# Altium project Control_Board_Model_C.PrjPcb (part 1 of 4)
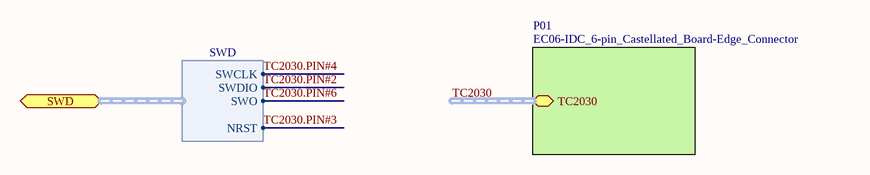
[diagram p0: SWD_TagConnect.SchDoc]
_address1: 30 N Gould St suite 4000; _address2: Sheridan WY 82801; _ApprovedBy: PGU; _BoardName: Control_Board; _CompanyName: Acme_CPU; _DateCode: 2021.12; _DocumentDate: 20210305; _HWEngineer: VSI; _PCBModel: C202; _PCBNumber: 001; _Revision: 0.1; _Title: Control_Board
12 sheets, 131 parts. Net scope: hierarchical (ports join the sheet entries above them; power ports are global).
Board files: Control_Board_Model_C_Rigid_Flex.PcbDoc, Control_Board_Model_C_Rigid_Flex_Flipped.PcbDoc
Sheets:
  SWD_TagConnect.SchDoc
  Analog_Signal_Conditioner_V2.SchDoc
  Top_Level_Block_Diagram.SchDoc
    TCPC = USB_Type-C_Port_V2.0.SchDoc
    TP = Test_Points.SchDoc
    BC = bq25611d_Battery_Charger.SchDoc
    P109 = BG95_Broadband_Modem.SchDoc
      BG95_RF = BG95_RF.SchDoc
      BG95_VLT = BG95_VLT.SchDoc
    AUDIO = Audio_Module.SchDoc
      CODEC = CMX655D_Audio_CODEC_PA.SchDoc
  SIT1533_Oscillator.SchDoc

## Sheet SWD_TagConnect.SchDoc: Tag-Connect SWD Port
size A4; DocumentNumber: 7; SheetNumber: 7; SheetTotal: 51

### Sub-sheets
P01 = EC06-IDC_6-pin_Castellated_Board-Edge_Connector (file not in this document): TC2030 (harness TC2030)

### Ports
SWD (harness SWD)

### Harnesses
SWD: SWDIO, SWCLK, NRST, SWO

### Nets
TC2030.PIN#2: port SWD.SWDIO
TC2030.PIN#3: port SWD.NRST
TC2030.PIN#4: port SWD.SWCLK
TC2030.PIN#6: port SWD.SWO

### Buses and harness runs
harness TC2030 = sheet P01/TC2030

### Notes on the sheet
- Title
- Size:
- Date:
- A4
- Number:
- Time:
- Revision:
- Sheet
- of
- File:

## Sheet Analog_Signal_Conditioner_V2.SchDoc: Analog Signal Conditioner
size A4; DocumentNumber: 6; SheetNumber: 6; SheetTotal: 51
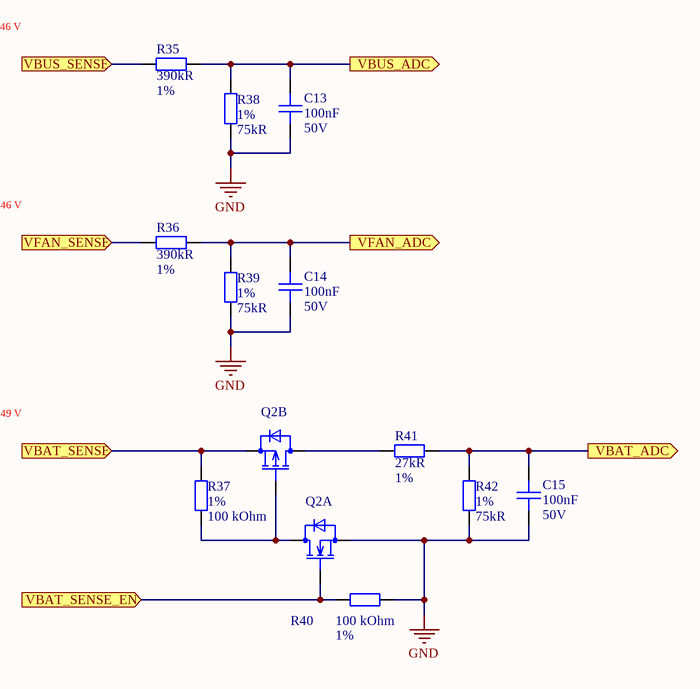
[diagram p1: Analog_Signal_Conditioner_V2.SchDoc]

### Parts
C13  Capacitance: 100nF  Voltage: 50V  [C0402]  (hidden comment: CAP CER 0.1UF 50V X7R 0402)
C14  Capacitance: 100nF  Voltage: 50V  [C0402]  (hidden comment: CAP CER 0.1UF 50V X7R 0402)
C15  Capacitance: 100nF  Voltage: 50V  [C0402]  (hidden comment: CAP CER 0.1UF 50V X7R 0402)
Q2  EM6M2T2R  [SON_400UV-7_DIO]  (value not drawn)  (parts A,B of 2)
R35  Resistance: 390kR  Tolerance: 1%  [R0402]  (hidden comment: RES SMD 390K OHM 1% 1/16W 0402)
R36  Resistance: 390kR  Tolerance: 1%  [R0402]  (hidden comment: RES SMD 390K OHM 1% 1/16W 0402)
R37  Tolerance: 1%  Resistance: 100 kOhm  [R0402]  (hidden comment: RES SMD 100K OHM 1% 1/16W 0402)
R38  Tolerance: 1%  Resistance: 75kR  [R0402]  (hidden comment: RES SMD 75K OHM 1% 1/16W 0402)
R39  Tolerance: 1%  Resistance: 75kR  [R0402]  (hidden comment: RES SMD 75K OHM 1% 1/16W 0402)
R40  Tolerance: 1%  Resistance: 100 kOhm  [R0402]  (hidden comment: RES SMD 100K OHM 1% 1/16W 0402)
R41  Resistance: 27kR  Tolerance: 1%  [R0402]  (hidden comment: RES SMD 27K OHM 1% 1/16W 0402)
R42  Tolerance: 1%  Resistance: 75kR  [R0402]  (hidden comment: RES SMD 75K OHM 1% 1/16W 0402)

### Ports
VBAT_ADC (out), VBAT_SENSE (in), VBAT_SENSE_EN (in), VBUS_ADC (out), VBUS_SENSE (in), VFAN_ADC (out), VFAN_SENSE (in)

### Nets
GND: C13.1 C14.1 C15.1 Q2.1(S) R38.1 R39.1 R40.1 R42.1
NetC13_2: C13.2 R35.2 R38.2 ; port VBUS_ADC
NetC14_2: C14.2 R36.2 R39.2 ; port VFAN_ADC
NetC15_2: C15.2 R41.2 R42.2 ; port VBAT_ADC
NetQ2_2: Q2.2(G) R40.2 ; port VBAT_SENSE_EN
NetQ2_3: Q2.3(D) R41.1
NetQ2_4: Q2.4(S) R37.2 ; port VBAT_SENSE
NetQ2_5: Q2.5(G) Q2.6(D) R37.1
NetR35_1: R35.1 ; port VBUS_SENSE
NetR36_1: R36.1 ; port VFAN_SENSE

### Notes on the sheet
- (near R35) VBUS_SENSE max = 20.46 V
- (near R36) VFAN_SENSE max = 20.46 V
- VBAT_SENSE max = 4.49 V
- Title
- Size:
- Date:
- A4
- Number:
- Time:
- Revision:
- Sheet
- of
- File:

### Library data of the parts
C13-C15 = CAP CER 0.1UF 50V X7R 0402: 0.1µF ±10% 50V Ceramic Capacitor X7R 0402 (1005 Metric); Manufacturer Part Number: CGA2B3X7R1H104K050BB; Manufacturer: TDK; Supplier 1: Digi-Key; Stock 1: 2925303; Pricing 1: 1=0.17, 10=0.118, 50=0.0668, 100=0.0553, 500=0.0388, 1000=0.0321, 2500=0.0299, 5000=0.0273 (USD); Mount: Surface Mount; Case Code (Metric): 1005; Case Code (Imperial): 0402; Min Operating Temperature: -55°C; Max Operating Temperature: 125°C; Tolerance: 10%; Dielectric: X7R; Voltage Rating: 50V; Voltage Rating (DC): 50V; Packaging: Tape and Reel; Package Quantity: 1; Termination: SMD/SMT; Composition: Ceramic; Length: 1mm; Height: 0.5mm; Width: 0.02inch; Thickness: 0.022inch; Depth: 0.5mm; REACH SVHC: No SVHC; Lead Free: Lead Free; ComponentLink1URL: http://product.tdk.com/capacitor/mlcc/en/documents/mlccspec_automotive_general_midvoltage_en.pdf?src-supplier=Future+Electronics; ComponentLink1Description: http://product.tdk.com/capacitor/mlcc/en/documents/mlccspec_automotive_general_midvoltage_en.pdf?src-supplier=Future+Electronics; ComponentLink2URL: http://www.farnell.com/datasheets/1807242.pdf?src-supplier=Element14; ComponentLink2Description: http://www.farnell.com/datasheets/1807242.pdf?src-supplier=Element14; ComponentLink3URL: http://www.mouser.com/ds/2/400/lcc_automotive_general_en-843974.pdf?src-supplier=Mouser; ComponentLink3Description: http://www.mouser.com/ds/2/400/lcc_automotive_general_en-843974.pdf?src-supplier=Mouser; ComponentLink4URL: http://www.farnell.com/datasheets/1936565.pdf?src-supplier=Element14; ComponentLink4Description: http://www.farnell.com/datasheets/1936565.pdf?src-supplier=Element14; ComponentLink5URL: http://www.farnell.com/datasheets/1735392.pdf?src-supplier=Element14; ComponentLink5Description: http://www.farnell.com/datasheets/1735392.pdf?src-supplier=Element14; Supplier Part Number 1: 445-6899-1-ND; Case/Package: 0402; Weight: 2.3E-05oz; Ratings: AEC-Q200; ClassName: STM32G473CETx
Q2 = ARRAY MOSFET N/P-CH 20V 0.2A EMT6: Mosfet Array N and P-Channel 20V 200mA 150mW Surface Mount EMT6; Manufacturer: Rohm; Rds On Max: 1R; Input Capacitance: 25pF; Supplier 1: Digi-Key; Manufacturer Part Number: EM6M2T2R; Stock 1: 84378; Pricing 1: 1=0.44, 10=0.375, 25=0.35, 100=0.26, 250=0.247, 500=0.203, 1000=0.165, 2500=0.155 (USD); Mount: Surface Mount; Case/Package: SOT-23-5; Number of Pins: 6; Min Operating Temperature: -55°C; Max Operating Temperature: 150°C; Packaging: Tape and Reel; Package Quantity: 1; Drain to Source Voltage (Vdss): 20V; Continuous Drain Current (ID): 200mA; Max Power Dissipation: 150mW; Drain to Source Resistance: 1R; FET Type: N and P-Channel; Radiation Hardening: No; Lead Free: Lead Free; ComponentLink1URL: http://rohmfs.rohm.com/en/techdata_basic/transistor/taping/EMT6_T2R_taping.pdf?src-supplier=Digi-Key; ComponentLink1Description: http://rohmfs.rohm.com/en/techdata_basic/transistor/taping/EMT6_T2R_taping.pdf?src-supplier=Digi-Key; Supplier Part Number 1: EM6M2T2RCT-ND; ClassName: STM32G473CETx
R35 R36 = RES SMD 390K OHM 1% 1/16W 0402: 390 kOhms ±1% 0.063W, 1/16W Chip Resistor 0402 (1005 Metric) Moisture Resistant Thick Film; Manufacturer: Yageo; Manufacturer Part Number: RC0402FR-07390KL; Power Rating: 62.5mW; Voltage Rating: 50V; Temperature Coefficient: 100ppm/°C; Max Power Dissipation: 63mW; Supplier 1: Digi-Key; Stock 1: 118017; Pricing 1: 1=0.1, 10=0.016, 100=0.0064, 1000=0.0029, 2500=0.0025, 5000=0.0021 (USD); Case/Package: 0402; Weight: 2.3E-05oz; Case Code (Imperial): 0402; Case Code (Metric): 1005; Min Operating Temperature: -55°C; Max Operating Temperature: 155°C; Packaging: Tape and Reel; Composition: Thick Film; Number of Terminations: 2; Termination: SMD/SMT; Military Standard: Not; Features: Moisture Resistant; Length: 1mm; Height: 0.016inch; Width: 0.02inch; Depth: 0.5mm; REACH SVHC: Unknown; Lead Free: Lead Free; ComponentLink1URL: http://www.yageo.com/documents/recent/PYu-RC0402_51_RoHS_L_6.pdf?src-supplier=Future+Electronics; ComponentLink1Description: http://www.yageo.com/documents/recent/PYu-RC0402_51_RoHS_L_6.pdf?src-supplier=Future+Electronics; ComponentLink2URL: http://www.farnell.com/datasheets/2167052.pdf?src-supplier=Element14; ComponentLink2Description: http://www.farnell.com/datasheets/2167052.pdf?src-supplier=Element14; ComponentLink3URL: http://www.mouser.com/ds/2/447/PYu-RC0402_51_RoHS_L_6_r-8721.pdf?src-supplier=Mouser; ComponentLink3Description: http://www.mouser.com/ds/2/447/PYu-RC0402_51_RoHS_L_6_r-8721.pdf?src-supplier=Mouser; Supplier Part Number 1: YAG3143CT-ND; ClassName: STM32G473CETx; Mount: Surface Mount
R37 R40 = RES SMD 100K OHM 1% 1/16W 0402: 100 kOhms ±1% 0.063W, 1/16W Chip Resistor 0402 (1005 Metric) Moisture Resistant Thick Film; Manufacturer: Yageo; Manufacturer Part Number: RC0402FR-07100KL; Temperature Coefficient: 100ppm/°C; Power Rating: 63mW; Voltage Rating: 50V; Supplier 1: Digi-Key; Stock 1: 47448883; Pricing 1: 1=0.1, 10=0.016, 100=0.0064, 1000=0.0029, 2500=0.0025, 5000=0.0021 (USD); Case Code (Metric): 1005; Case Code (Imperial): 0402; Min Operating Temperature: -55°C; Max Operating Temperature: 155°C; Composition: Thick Film; Packaging: Tape and Reel; Package Quantity: 1; Number of Terminations: 2; Termination: SMD/SMT; Military Standard: Not; Max Power Dissipation: 63mW; Working Voltage: 50V; Features: Moisture Resistant; Length: 0.039inch; Height: 0.016inch; Width: 0.02inch; Depth: 0.5mm; REACH SVHC: No SVHC; Lead Free: Lead Free; ComponentLink1URL: http://www.yageo.com/documents/recent/PYu-RC_Group_51_RoHS_L_10.pdf?src-supplier=Digi-Key; ComponentLink1Description: http://www.yageo.com/documents/recent/PYu-RC_Group_51_RoHS_L_10.pdf?src-supplier=Digi-Key; ComponentLink2URL: http://www.farnell.com/datasheets/1018594.pdf?src-supplier=Element14; ComponentLink2Description: http://www.farnell.com/datasheets/1018594.pdf?src-supplier=Element14; ComponentLink3URL: http://www.yageo.com/documents/recent/PYu-RC_Group_51_RoHS_L_9.pdf?src-supplier=Verical; ComponentLink3Description: http://www.yageo.com/documents/recent/PYu-RC_Group_51_RoHS_L_9.pdf?src-supplier=Verical; ComponentLink4URL: http://www.yageo.com/documents/recent/PYu-RC_Group_51_RoHS_L_9.pdf?src-supplier=Mouser; ComponentLink4Description: http://www.yageo.com/documents/recent/PYu-RC_Group_51_RoHS_L_9.pdf?src-supplier=Mouser; ComponentLink5URL: http://documents.rs-components.com/techlib://itc_doclist_GB.htm?stockno=6185797&src-supplier=RSComponents; ComponentLink5Description: http://documents.rs-components.com/techlib://itc_doclist_GB.htm?stockno=6185797&src-supplier=RSComponents; Supplier Part Number 1: 311-100KLRDKR-ND; Case/Package: 0402; ClassName: STM32G473CETx; Mount: Surface Mount
R38 R39 R42 = RES SMD 75K OHM 1% 1/16W 0402: 75 kOhms ±1% 0.063W, 1/16W Chip Resistor 0402 (1005 Metric) Automotive AEC-Q200 Thick Film; Manufacturer: Stackpole Electronics; Manufacturer Part Number: RMCF0402FT75K0; Power Rating: 63mW; Temperature Coefficient: 100ppm/°C; Supplier 1: Digi-Key; Stock 1: 24693; Pricing 1: 1=0.1, 10=0.014, 100=0.0058, 1000=0.0026, 2500=0.0023, 5000=0.0019 (USD); Mount: Surface Mount; Case/Package: 0402; Case Code (Metric): 1005; Case Code (Imperial): 0402; Contact Plating: Tin,Matte; Min Operating Temperature: -55°C; Max Operating Temperature: 155°C; Features: Automotive AEC-Q200; Packaging: Tape and Reel; Composition: Thick Film; Number of Terminations: 2; Military Standard: Not; Max Power Dissipation: 63mW; Length: 0.039inch; Height: 0.016inch; Width: 0.02inch; Depth: 0.5mm; Radiation Hardening: No; Lead Free: Lead Free; ComponentLink1URL: https://www.seielect.com/catalog/SEI-Packaging.pdf?src-supplier=Digi-Key; ComponentLink1Description: https://www.seielect.com/catalog/SEI-Packaging.pdf?src-supplier=Digi-Key; ComponentLink2URL: http://www.seielect.com/Catalog/Sei-RMC.pdf?src-supplier=Future+Electronics; ComponentLink2Description: http://www.seielect.com/Catalog/Sei-RMC.pdf?src-supplier=Future+Electronics; ComponentLink3URL: https://www.seielect.com/catalog/SEI-RMCF_RMCP.pdf?src-supplier=Avnet; ComponentLink3Description: https://www.seielect.com/catalog/SEI-RMCF_RMCP.pdf?src-supplier=Avnet; ComponentLink4URL: http://components.arrow.com/part/dataview/47811039S7743759N1174?src-supplier=Arrow; ComponentLink4Description: http://components.arrow.com/part/dataview/47811039S7743759N1174?src-supplier=Arrow; ComponentLink5URL: https://www.verical.com/server-webapp/html/getDatasheet?partID=492569&src-supplier=Verical; ComponentLink5Description: https://www.verical.com/server-webapp/html/getDatasheet?partID=492569&src-supplier=Verical; Supplier Part Number 1: RMCF0402FT75K0CT-ND; ClassName: STM32G473CETx
R41 = RES SMD 27K OHM 1% 1/16W 0402: 27 kOhms ±1% 0.063W, 1/16W Chip Resistor 0402 (1005 Metric) Moisture Resistant Thick Film; Manufacturer: Yageo; Manufacturer Part Number: RC0402FR-0727KL; Power Rating: 63mW; Voltage Rating: 50V; Temperature Coefficient: 100ppm/°C; Supplier 1: Digi-Key; Stock 1: 1508379; Pricing 1: 1=0.1, 10=0.016, 100=0.0064, 1000=0.0029, 2500=0.0025, 5000=0.0021 (USD); Case/Package: 0402; Case Code (Imperial): 0402; Case Code (Metric): 1005; Min Operating Temperature: -55°C; Max Operating Temperature: 155°C; Packaging: Tape and Reel; Composition: Thick Film; Number of Terminations: 2; Termination: SMD/SMT; Military Standard: Not; Max Power Dissipation: 63mW; Features: Moisture Resistant; Length: 1mm; Height: 0.016inch; Width: 0.02inch; Depth: 0.5mm; Lead Free: Lead Free; ComponentLink1URL: http://www.farnell.com/datasheets/2167052.pdf?src-supplier=Element14; ComponentLink1Description: http://www.farnell.com/datasheets/2167052.pdf?src-supplier=Element14; ComponentLink2URL: http://documents.rs-components.com/techlib://itc_doclist_GB.htm?stockno=6186475&src-supplier=RSComponents; ComponentLink2Description: http://documents.rs-components.com/techlib://itc_doclist_GB.htm?stockno=6186475&src-supplier=RSComponents; ComponentLink3URL: http://www.yageo.com/documents/recent/PYu-RC_Group_51_RoHS_L_10.pdf?src-supplier=Digi-Key; ComponentLink3Description: http://www.yageo.com/documents/recent/PYu-RC_Group_51_RoHS_L_10.pdf?src-supplier=Digi-Key; Supplier Part Number 1: 311-27.0KLRCT-ND; ComponentLink4URL: http://www.yageo.com/documents/recent/PYu-RC0402_51_RoHS_L_6_r.pdf?src-supplier=Future+Electronics; ComponentLink4Description: http://www.yageo.com/documents/recent/PYu-RC0402_51_RoHS_L_6_r.pdf?src-supplier=Future+Electronics; Package Quantity: 10000; REACH SVHC: Unknown; ClassName: STM32G473CETx; Mount: Surface Mount

## Sheet Top_Level_Block_Diagram.SchDoc: BLDC Motor Driver Block Diagram
size A3; DocumentNumber: 1; SheetNumber: 1; SheetTotal: 51
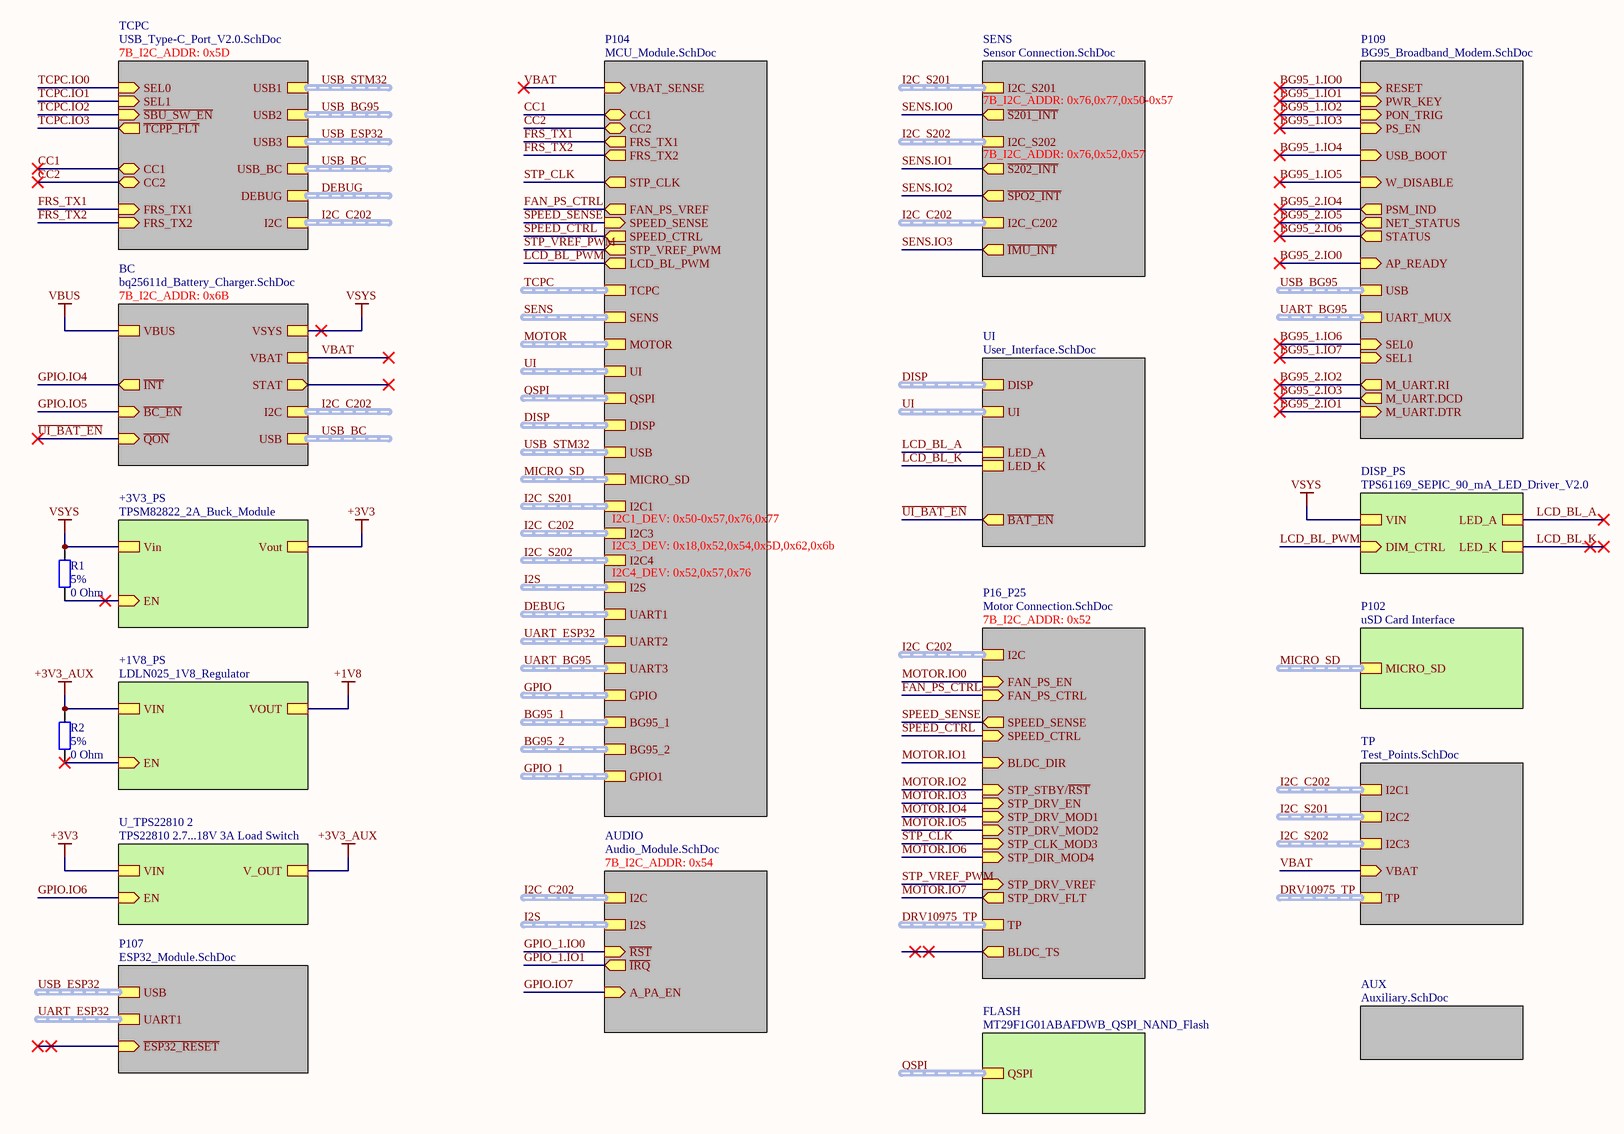
[diagram p2: Top_Level_Block_Diagram.SchDoc]

### Parts
R1  Tolerance: 5%  Resistance: 0 Ohm  [R0402]  (hidden comment: RES SMD 0 OHM JUMPER 1/16W 0402)
R2  Tolerance: 5%  Resistance: 0 Ohm  [R0402]  (hidden comment: RES SMD 0 OHM JUMPER 1/16W 0402)

### Sub-sheets
+1V8_PS = LDLN025_1V8_Regulator (file not in this document): EN (in), VIN, VOUT
+3V3_PS = TPSM82822_2A_Buck_Module (file not in this document): Vout, Vin, EN (in)
AUDIO = Audio_Module.SchDoc: I2S (harness I2S), I2C (harness I2C), ~{RST} (in), ~{IRQ} (out), A_PA_EN (in)  | 7B_I2C_ADDR: 0x54
AUX = Auxiliary.SchDoc (file not in this document): no entries
BC = bq25611d_Battery_Charger.SchDoc: VSYS, VBUS, ~{QON} (in), USB (harness USB), I2C (harness I2C), ~{INT} (out), STAT (out), ~{BC_EN} (in), VBAT  | 7B_I2C_ADDR: 0x6B
DISP_PS = TPS61169_SEPIC_90_mA_LED_Driver_V2.0 (file not in this document): VIN, LED_K, DIM_CTRL (in), LED_A
FLASH = MT29F1G01ABAFDWB_QSPI_NAND_Flash (file not in this document): QSPI (harness QSPI)
P16_P25 = Motor Connection.SchDoc (file not in this document): SPEED_CTRL (in), SPEED_SENSE (out), FAN_PS_CTRL (in), BLDC_DIR (in), I2C (harness I2C), STP_STBY/~{RST} (in), STP_DRV_EN (in), STP_DRV_MOD1 (in), STP_DRV_MOD2 (in), STP_CLK_MOD3 (in), STP_DIR_MOD4 (in), STP_DRV_VREF (in), STP_DRV_FLT (out), FAN_PS_EN (in), TP (harness DRV10975_TP), BLDC_TS (out)  | 7B_I2C_ADDR: 0x52
P102 = uSD Card Interface (file not in this document): MICRO_SD (harness MICRO_SD)
P104 = MCU_Module.SchDoc (file not in this document): FAN_PS_VREF (out), SPEED_CTRL (out), SPEED_SENSE (in), CC2 (bidir), CC1 (bidir), I2C1 (harness I2C), VBAT_SENSE (in), MICRO_SD (harness MICRO_SD), DISP (harness DISP_SPI), USB (harness USB), STP_CLK (out), STP_VREF_PWM (out), LCD_BL_PWM (out), QSPI (harness QSPI), FRS_TX1 (out), FRS_TX2 (out), I2C3 (harness I2C), UART1 (harness DEBUG), I2C4 (harness I2C), UART3 (harness UART), I2S (harness I2S), UART2 (harness UART), GPIO (harness GPIO), MOTOR (harness GPIO), BG95_1 (harness GPIO), SENS (harness GPIO), BG95_2 (harness GPIO), UI (harness GPIO), TCPC (harness GPIO), GPIO1 (harness GPIO)  | I2C3_DEV: 0x18,0x52,0x54,0x5D,0x62,0x6b; I2C1_DEV: 0x50-0x57,0x76,0x77; I2C4_DEV: 0x52,0x57,0x76
P107 = ESP32_Module.SchDoc (file not in this document): ~{ESP32_RESET} (in), UART1 (harness UART), USB (harness USB)
P109 = BG95_Broadband_Modem.SchDoc: PWR_KEY (in), PON_TRIG (in), W_DISABLE (in), USB_BOOT (in), NET_STATUS (out), AP_READY (in), STATUS (out), PSM_IND (out), PS_EN (in), RESET (in), USB (harness USB), SEL1 (in), SEL0 (in), UART_MUX (harness UART), M_UART.RI (out), M_UART.DCD (out), M_UART.DTR (in)
SENS = Sensor Connection.SchDoc (file not in this document): ~{S201_INT} (out), I2C_S201 (harness I2C), I2C_S202 (harness I2C), ~{S202_INT} (out), ~{SPO2_INT} (out), I2C_C202 (harness I2C), ~{IMU_INT} (out)  | 7B_I2C_ADDR: 0x76,0x77,0x50-0x57; 7B_I2C_ADDR: 0x76,0x52,0x57
TCPC = USB_Type-C_Port_V2.0.SchDoc: CC1 (bidir), CC2 (bidir), USB1 (harness USB), USB2 (harness USB), SEL1 (in), SEL0 (in), ~{TCPP_FLT} (out), USB3 (harness USB), USB_BC (harness USB), FRS_TX1 (in), FRS_TX2 (in), I2C (harness I2C), ~{SBU_SW_EN} (in), DEBUG (harness DEBUG)  | 7B_I2C_ADDR: 0x5D
TP = Test_Points.SchDoc: I2C1 (harness I2C), I2C2 (harness I2C), I2C3 (harness I2C), VBAT (in), TP (harness DRV10975_TP)
U_TPS22810 2 = TPS22810 2.7...18V 3A Load Switch (file not in this document): EN (in), V_OUT, VIN
UI = User_Interface.SchDoc (file not in this document): ~{BAT_EN} (out), DISP (harness DISP_SPI), LED_A, LED_K, UI (harness GPIO)

### Nets
+3V3: sheet +3V3_PS/Vout, sheet U_TPS22810 2/VIN
+3V3_AUX: R2.2 ; sheet +1V8_PS/VIN, sheet U_TPS22810 2/V_OUT
VSYS: R1.2 ; sheet BC/VSYS, sheet +3V3_PS/Vin, sheet DISP_PS/VIN
~{UI_BAT_EN}: sheet BC/~{QON}, sheet UI/~{BAT_EN}
BG95_1.IO3: sheet P109/PS_EN
BG95_1.IO5: sheet P109/W_DISABLE  [project net B1_3]
BG95_2.IO0: sheet P109/AP_READY  [project net B1_0]
BG95_2.IO1: sheet P109/M_UART.DTR  [project net B1_4]
BG95_2.IO2: sheet P109/M_UART.RI  [project net B1_5]
BG95_2.IO3: sheet P109/M_UART.DCD  [project net B1_6]
BG95_2.IO4: sheet P109/PSM_IND  [project net B1_7]
BG95_2.IO5: sheet P109/NET_STATUS  [project net B1_2]
BG95_2.IO6: sheet P109/STATUS  [project net B1_1]
CC1: sheet TCPC/CC1, sheet P104/CC1
CC2: sheet TCPC/CC2, sheet P104/CC2
FAN_PS_CTRL: sheet P104/FAN_PS_VREF, sheet P16_P25/FAN_PS_CTRL
FRS_TX1: sheet TCPC/FRS_TX1, sheet P104/FRS_TX1
FRS_TX2: sheet TCPC/FRS_TX2, sheet P104/FRS_TX2
GPIO.IO6: sheet U_TPS22810 2/EN
GPIO.IO7: sheet AUDIO/A_PA_EN
LCD_BL_A: sheet UI/LED_A, sheet DISP_PS/LED_A
LCD_BL_K: sheet UI/LED_K, sheet DISP_PS/LED_K
LCD_BL_PWM: sheet P104/LCD_BL_PWM, sheet DISP_PS/DIM_CTRL
MOTOR.IO0: sheet P16_P25/FAN_PS_EN
MOTOR.IO1: sheet P16_P25/BLDC_DIR
MOTOR.IO2: sheet P16_P25/STP_STBY/~{RST}
MOTOR.IO3: sheet P16_P25/STP_DRV_EN
MOTOR.IO4: sheet P16_P25/STP_DRV_MOD1
MOTOR.IO5: sheet P16_P25/STP_DRV_MOD2
MOTOR.IO6: sheet P16_P25/STP_DIR_MOD4
MOTOR.IO7: sheet P16_P25/STP_DRV_FLT
SENS.IO0: sheet SENS/~{S201_INT}
SENS.IO1: sheet SENS/~{S202_INT}
SENS.IO2: sheet SENS/~{SPO2_INT}
SENS.IO3: sheet SENS/~{IMU_INT}
SPEED_CTRL: sheet P104/SPEED_CTRL, sheet P16_P25/SPEED_CTRL
SPEED_SENSE: sheet P104/SPEED_SENSE, sheet P16_P25/SPEED_SENSE
STP_CLK: sheet P104/STP_CLK, sheet P16_P25/STP_CLK_MOD3
STP_VREF_PWM: sheet P104/STP_VREF_PWM, sheet P16_P25/STP_DRV_VREF
TCPC.IO2: sheet TCPC/~{SBU_SW_EN}  [project net ~{SBU_SW_EN}]
TCPC.IO3: sheet TCPC/~{TCPP_FLT}
VBAT: sheet TP/VBAT, sheet P104/VBAT_SENSE, sheet BC/VBAT
NetR1_1: R1.1 ; sheet +3V3_PS/EN
NetR2_1: R2.1 ; sheet +1V8_PS/EN

### Buses and harness runs
harness BG95_1 = sheet P104/BG95_1
harness BG95_2 = sheet P104/BG95_2
harness DEBUG = sheet P104/UART1
harness DEBUG = sheet TCPC/DEBUG
harness DISP = sheet P104/DISP
harness DISP = sheet UI/DISP
harness DRV10975_TP = sheet P16_P25/TP
harness DRV10975_TP = sheet TP/TP
harness GPIO = sheet P104/GPIO
harness GPIO_1 = sheet P104/GPIO1
harness I2C_C202 = sheet AUDIO/I2C
harness I2C_C202 = sheet BC/I2C
harness I2C_C202 = sheet P16_P25/I2C
harness I2C_C202 = sheet P104/I2C3
harness I2C_C202 = sheet SENS/I2C_C202
harness I2C_C202 = sheet TCPC/I2C
harness I2C_C202 = sheet TP/I2C1
harness I2C_S201 = sheet P104/I2C1
harness I2C_S201 = sheet SENS/I2C_S201
harness I2C_S201 = sheet TP/I2C2
harness I2C_S202 = sheet P104/I2C4
harness I2C_S202 = sheet SENS/I2C_S202
harness I2C_S202 = sheet TP/I2C3
harness I2S = sheet AUDIO/I2S
harness I2S = sheet P104/I2S
harness MICRO_SD = sheet P102/MICRO_SD
harness MICRO_SD = sheet P104/MICRO_SD
harness MOTOR = sheet P104/MOTOR
harness QSPI = sheet FLASH/QSPI
harness QSPI = sheet P104/QSPI
harness SENS = sheet P104/SENS
harness TCPC = sheet P104/TCPC
harness UART_BG95 = sheet P104/UART3
harness UART_BG95 = sheet P109/UART_MUX
harness UART_ESP32 = sheet P104/UART2
harness UART_ESP32 = sheet P107/UART1
harness UI = sheet P104/UI
harness UI = sheet UI/UI
harness USB_BC = sheet BC/USB
harness USB_BC = sheet TCPC/USB_BC
harness USB_BG95 = sheet P109/USB
harness USB_BG95 = sheet TCPC/USB2
harness USB_ESP32 = sheet P107/USB
harness USB_ESP32 = sheet TCPC/USB3
harness USB_STM32 = sheet P104/USB
harness USB_STM32 = sheet TCPC/USB1

### Notes on the sheet
- Title
- Size:
- Date:
- A3
- Number:
- Time:
- Revision:
- Sheet
- of
- File:

### Library data of the parts
R1 R2 = RES SMD 0 OHM JUMPER 1/16W 0402: 0 Ohms Jumper 0.063W, 1/16W Chip Resistor 0402 (1005 Metric) Moisture Resistant Thick Film; Manufacturer: Yageo; Manufacturer Part Number: RC0402JR-070RL; Power Rating: 62.5mW; Voltage Rating: 50V; Max Power Dissipation: 63mW; Temperature Coefficient: 200ppm/°C; Supplier 1: Digi-Key; Stock 1: 46057148; Pricing 1: 1=0.1, 10=0.013, 25=0.0092, 50=0.0072, 100=0.0053, 250=0.004, 500=0.0032, 1000=0.0024, 5000=0.0017 (USD); Contact Plating: Tin,Matte; Case Code (Metric): 1005; Case Code (Imperial): 0402; Min Operating Temperature: -55°C; Max Operating Temperature: 155°C; Packaging: Tape and Reel; Composition: Thick Film; Package Quantity: 1; Number of Terminations: 2; Termination: SMD/SMT; Military Standard: Not; Features: Moisture Resistant; Length: 1mm; Height: 0.016inch; Width: 0.02inch; Depth: 0.5mm; Radiation Hardening: No; REACH SVHC: Unknown; Lead Free: Lead Free; ComponentLink1URL: http://www.yageo.com/documents/recent/PYu-RC_Group_51_RoHS_L_10.pdf?src-supplier=Digi-Key; ComponentLink1Description: http://www.yageo.com/documents/recent/PYu-RC_Group_51_RoHS_L_10.pdf?src-supplier=Digi-Key; ComponentLink2URL: http://www.yageo.com/documents/recent/PYu-RC0402_51_RoHS_L_6.pdf?src-supplier=Avnet+Europe; ComponentLink2Description: http://www.yageo.com/documents/recent/PYu-RC0402_51_RoHS_L_6.pdf?src-supplier=Avnet+Europe; ComponentLink3URL: http://www.farnell.com/datasheets/1018594.pdf?src-supplier=Element14; ComponentLink3Description: http://www.farnell.com/datasheets/1018594.pdf?src-supplier=Element14; ComponentLink4URL: https://www.verical.com/server-webapp/html/getDatasheet?partID=326379&src-supplier=Verical; ComponentLink4Description: https://www.verical.com/server-webapp/html/getDatasheet?partID=326379&src-supplier=Verical; ComponentLink5URL: http://www.farnell.com/datasheets/2167052.pdf?src-supplier=Element14; ComponentLink5Description: http://www.farnell.com/datasheets/2167052.pdf?src-supplier=Element14; Supplier Part Number 1: 311-0.0JRCT-ND; Case/Package: 0402; Mount: Surface Mount
  R1: ClassName: +3V3_PS
  R2: ClassName: +1V8_PS

## Sheet USB_Type-C_Port_V2.0.SchDoc: USB Type-C PD Port Controller V2.0
size A4; DocumentNumber: 2; SheetNumber: 2; SheetTotal: 51
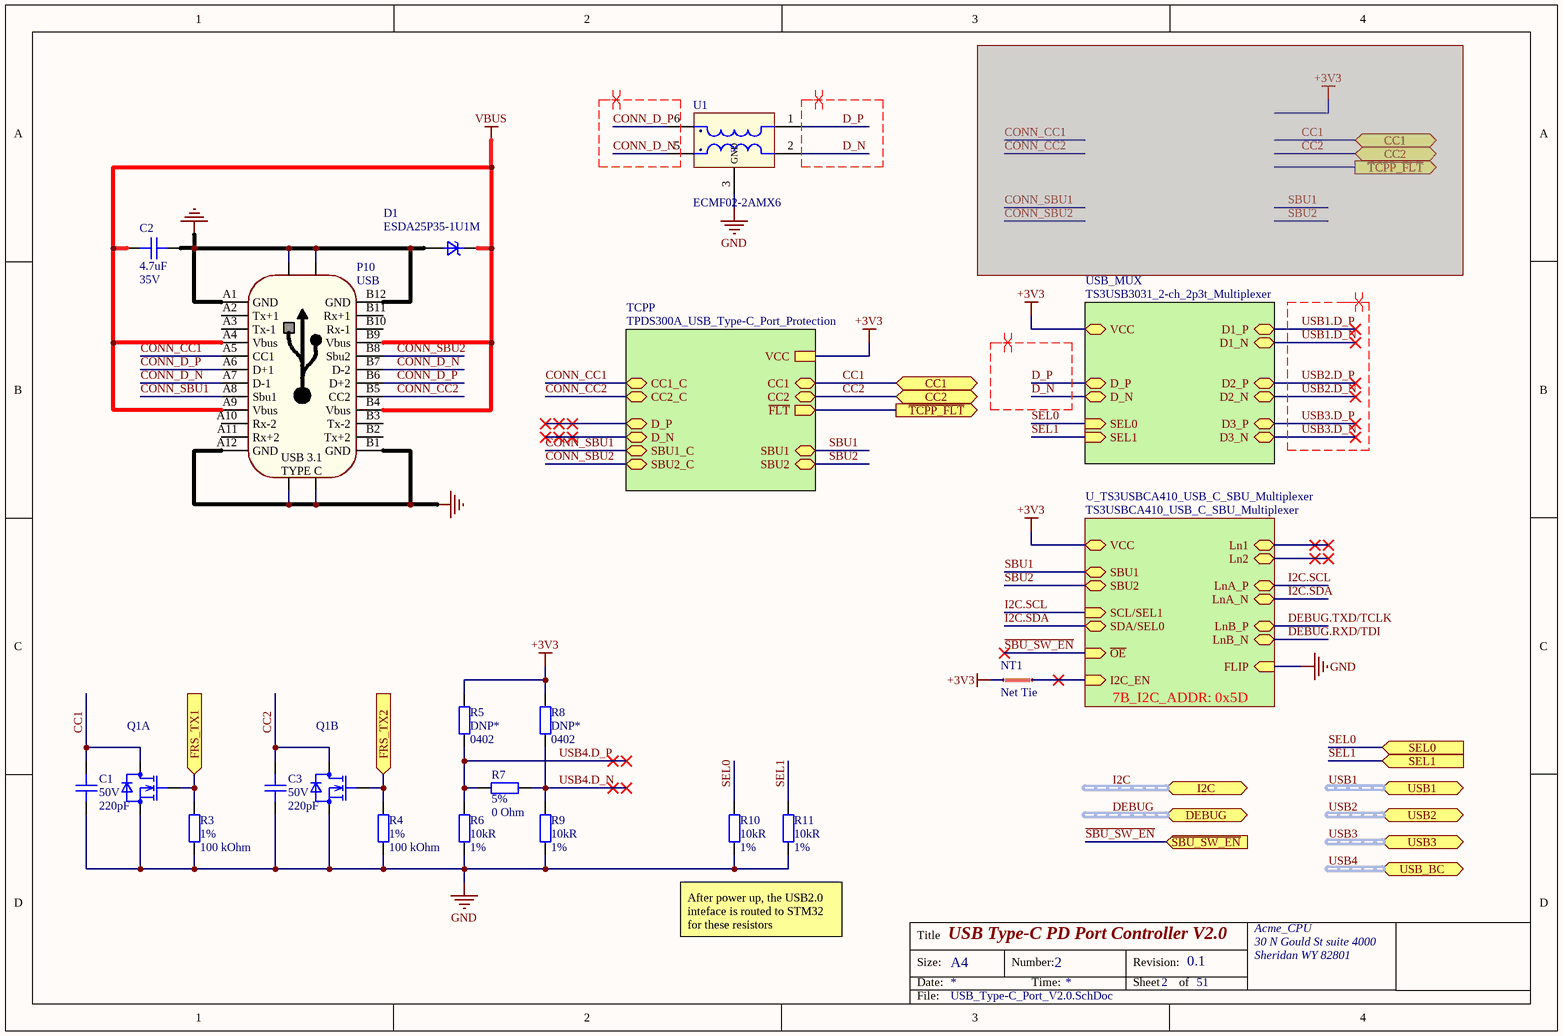
[diagram p3: USB_Type-C_Port_V2.0.SchDoc]

### Parts
C1  Voltage Rating: 50V  Capacitance: 220pF  [C0402]  (hidden comment: CAP CER 220PF 50V X7R 0402)
C2  Capacitance: 4.7uF  Voltage Rating: 35V  [C0805]  (hidden comment: CAP CER 4.7UF 35V X7R 0805)
C3  Voltage Rating: 50V  Capacitance: 220pF  [C0402]  (hidden comment: CAP CER 220PF 50V X7R 0402)
D1  ESDA25P35-1U1M  [ST_QFN_1610]
NT1  Net Tie  [Net Tie 6x30mil]  (net tie, no BOM)
P10  USB  [MOLEX_2012670005]
Q1  DMN32D2LV-7  [SON_400UV-7_DIO]  (value not drawn)  (parts A,B of 2)
R3  Tolerance: 1%  Resistance: 100 kOhm  [R0402]  (hidden comment: RES SMD 100K OHM 1% 1/16W 0402)
R4  Tolerance: 1%  Resistance: 100 kOhm  [R0402]  (hidden comment: RES SMD 100K OHM 1% 1/16W 0402)
R5  DNP*  Case/Package: 0402  [R0402]  (no BOM)
R6  Resistance: 10kR  Tolerance: 1%  [R0402]  (hidden comment: RES SMD 10K OHM 1% 1/16W 0402)
R7  Tolerance: 5%  Resistance: 0 Ohm  [R0402]  (hidden comment: RES SMD 0 OHM JUMPER 1/16W 0402)
R8  DNP*  Case/Package: 0402  [R0402]  (no BOM)
R9  Resistance: 10kR  Tolerance: 1%  [R0402]  (hidden comment: RES SMD 10K OHM 1% 1/16W 0402)
R10  Resistance: 10kR  Tolerance: 1%  [R0402]  (hidden comment: RES SMD 10K OHM 1% 1/16W 0402)
R11  Resistance: 10kR  Tolerance: 1%  [R0402]  (hidden comment: RES SMD 10K OHM 1% 1/16W 0402)
U1  ECMF02-2AMX6  [QFN-6L]

### Sub-sheets
TCPP = TPDS300A_USB_Type-C_Port_Protection (file not in this document): ~{FLT} (out), VCC, CC1 (bidir), CC2 (bidir), CC1_C (bidir), CC2_C (bidir), SBU1_C (bidir), SBU2_C (bidir), SBU1 (bidir), SBU2 (bidir), D_P (bidir), D_N (bidir)
U_TS3USBCA410_USB_C_SBU_Multiplexer = TS3USBCA410_USB_C_SBU_Multiplexer (file not in this document): LnB_P (bidir), LnB_N (bidir), LnA_P (bidir), VCC, Ln1 (bidir), Ln2 (bidir), SBU1 (bidir), SBU2 (bidir), LnA_N (bidir), SCL/SEL1 (in), I2C_EN (in), FLIP (in), SDA/SEL0 (bidir), ~{OE} (in)  | 7B_I2C_ADDR: 0x5D
USB_MUX = TS3USB3031_2-ch_2p3t_Multiplexer (file not in this document): VCC, D_P (bidir), D_N (bidir), D1_N (bidir), D1_P (bidir), D2_P (bidir), D2_N (bidir), D3_N (bidir), D3_P (bidir), SEL0 (in), SEL1 (in)

### Ports
CC1 (bidir), CC2 (bidir), DEBUG (harness DEBUG), FRS_TX1 (in), FRS_TX2 (in), I2C (harness I2C), SEL0 (in), SEL1 (in), USB1 (harness USB), USB2 (harness USB), USB3 (harness USB), USB_BC (harness USB), ~{SBU_SW_EN} (in), ~{TCPP_FLT} (out)

### Nets
+3V3: NT1.1 R5.1 R8.1 ; sheet USB_MUX/VCC, sheet U_TS3USBCA410_USB_C_SBU_Multiplexer/VCC, sheet TCPP/VCC
GND: C1.1 C2.2 C3.1 D1.2(A) P10.A1(GND) P10.A12(GND) P10.B1(GND) P10.B12(GND) P10.S1 P10.S2 P10.S3 P10.S4 Q1.1(S) Q1.4(S) R3.1 R4.1 R6.2 R9.2 R10.2 R11.2 U1.3(GND) ; sheet U_TS3USBCA410_USB_C_SBU_Multiplexer/FLIP
VBUS: C2.1 D1.1(K) P10.A4(Vbus) P10.A9(Vbus) P10.B4(Vbus) P10.B9(Vbus)
~{SBU_SW_EN}: port ~{SBU_SW_EN}, sheet U_TS3USBCA410_USB_C_SBU_Multiplexer/~{OE}
CC1: C1.2 Q1.6(D) ; port CC1, sheet TCPP/CC1
CC2: C3.2 Q1.3(D) ; port CC2, sheet TCPP/CC2
CONN_CC1: P10.A5(CC1) ; sheet TCPP/CC1_C
CONN_CC2: P10.B5(CC2) ; sheet TCPP/CC2_C
CONN_D_N: P10.A7(D-1) P10.B7(D-2) U1.5(OUT2)
CONN_D_P: P10.A6(D+1) P10.B6(D+2) U1.6(OUT1)
CONN_SBU1: P10.A8(Sbu1) ; sheet TCPP/SBU1_C
CONN_SBU2: P10.B8(Sbu2) ; sheet TCPP/SBU2_C
D_N: U1.2(INP2) ; sheet USB_MUX/D_N
D_P: U1.1(INP1) ; sheet USB_MUX/D_P
DEBUG.RXD/TDI: sheet U_TS3USBCA410_USB_C_SBU_Multiplexer/LnB_N
DEBUG.TXD/TCLK: sheet U_TS3USBCA410_USB_C_SBU_Multiplexer/LnB_P
FRS_TX1: Q1.2(G) R3.2 ; port FRS_TX1
FRS_TX2: Q1.5(G) R4.2 ; port FRS_TX2
I2C.SCL: sheet U_TS3USBCA410_USB_C_SBU_Multiplexer/LnA_P, sheet U_TS3USBCA410_USB_C_SBU_Multiplexer/SCL/SEL1
I2C.SDA: sheet U_TS3USBCA410_USB_C_SBU_Multiplexer/LnA_N, sheet U_TS3USBCA410_USB_C_SBU_Multiplexer/SDA/SEL0
SBU1: sheet U_TS3USBCA410_USB_C_SBU_Multiplexer/SBU1, sheet TCPP/SBU1
SBU2: sheet U_TS3USBCA410_USB_C_SBU_Multiplexer/SBU2, sheet TCPP/SBU2
SEL0: R10.1 ; port SEL0, sheet USB_MUX/SEL0
SEL1: R11.1 ; port SEL1, sheet USB_MUX/SEL1
TCPC.IO3: port ~{TCPP_FLT}, sheet TCPP/~{FLT}
USB1.D_N: sheet USB_MUX/D1_N
USB1.D_P: sheet USB_MUX/D1_P
USB2.D_N: sheet USB_MUX/D2_N
USB2.D_P: sheet USB_MUX/D2_P
USB3.D_N: sheet USB_MUX/D3_N
USB3.D_P: sheet USB_MUX/D3_P
USB4.D_N: R7.2 R8.2 R9.1
USB4.D_P: R5.2 R6.1 R7.1
NetNT1_2: NT1.2 ; sheet U_TS3USBCA410_USB_C_SBU_Multiplexer/I2C_EN

Not connected (* = marked no-connect by the designer): P10 A2(Tx+1) A3(Tx-1) A10(Rx-2) A11(Rx+2) B2(Tx+2) B3(Tx-2) B10(Rx-1) B11(Rx+1); U1 4(NC)

### Buses and harness runs
harness DEBUG = port DEBUG
harness I2C = port I2C
harness USB1 = port USB1
harness USB2 = port USB2
harness USB3 = port USB3
harness USB4 = port USB_BC

### Layout directives
differential pair: CONN_D_N, CONN_D_P, D_N, D_P, USB1.D_N, USB1.D_P, USB2.D_N, USB2.D_P, USB3.D_N, USB3.D_P

### Notes on the sheet
- After power up, the USB2.0 inteface is routed to STM32 for these resistors
- Title
- Size:
- Date:
- A4
- Number:
- Time:
- Revision:
- Sheet
- of
- File:
- (in symbol CONN 2012670005 RCP USB3.1 TYPEC 24P SMD RA) USB 3.1; TYPE C

### Library data of the parts
C1 C3 = CAP CER 220PF 50V X7R 0402: 220pF ±10% 50V Ceramic Capacitor X7R 0402 (1005 Metric); Manufacturer: Yageo; Manufacturer Part Number: CC0402KRX7R9BB221; Insulation Resistance: 100GR; Supplier 1: Digi-Key; Stock 1: 91221; Pricing 1: 1=0.1, 10=0.026, 50=0.014, 100=0.0114, 500=0.0081, 1000=0.0064, 2500=0.0058, 5000=0.0053 (USD); Mount: Surface Mount; Case/Package: 0402; Weight: 2.3E-05oz; Case Code (Metric): 1005; Case Code (Imperial): 0402; Min Operating Temperature: -55°C; Max Operating Temperature: 125°C; Tolerance: 10%; Packaging: Tape and Reel; Package Quantity: 1; Voltage Rating (DC): 50V; Dielectric: X7R; Termination: SMD/SMT; Composition: Ceramic; Length: 1mm; Height: 0.5mm; Width: 0.02inch; Thickness: 0.022inch; Depth: 0.5mm; REACH SVHC: No SVHC; Lead Free: Lead Free; ComponentLink1URL: http://www.yageo.com/documents/recent/UPY-GPHC_X7R_6.3V-to-50V_18.pdf?src-supplier=Digi-Key; ComponentLink1Description: http://www.yageo.com/documents/recent/UPY-GPHC_X7R_6.3V-to-50V_18.pdf?src-supplier=Digi-Key; ComponentLink2URL: http://www.farnell.com/datasheets/2167236.pdf?src-supplier=Farnell; ComponentLink2Description: http://www.farnell.com/datasheets/2167236.pdf?src-supplier=Farnell; ComponentLink3URL: http://www.yageo.com/documents/recent/UPY-GPHC_X7R_6.3V-to-50V_8.pdf?src-supplier=Avnet; ComponentLink3Description: http://www.yageo.com/documents/recent/UPY-GPHC_X7R_6.3V-to-50V_8.pdf?src-supplier=Avnet; ComponentLink4URL: http://www.farnell.com/datasheets/1489800.pdf?src-supplier=Element14; ComponentLink4Description: http://www.farnell.com/datasheets/1489800.pdf?src-supplier=Element14; ComponentLink5URL: http://www.mouser.com/ds/2/447/Yageo_UPY-GP_NP0_16V-to-50V_9-358835.pdf?src-supplier=Mouser; ComponentLink5Description: http://www.mouser.com/ds/2/447/Yageo_UPY-GP_NP0_16V-to-50V_9-358835.pdf?src-supplier=Mouser; Supplier Part Number 1: 311-1035-1-ND; Number of Pins: 2; Dielectric Material: Ceramic; Radiation Hardening: No; Halogen Free: Halogen Free; ComponentLink6URL: https://www.verical.com/server-webapp/html/getDatasheet?partID=403476&src-supplier=Verical; ComponentLink6Description: https://www.verical.com/server-webapp/html/getDatasheet?partID=403476&src-supplier=Verical; ComponentLink7URL: http://www.yageo.com/documents/recent/UPY-GPHC_X7R_6.3V-to-50V_8.pdf?src-supplier=Avnet+Europe; ComponentLink7Description: http://www.yageo.com/documents/recent/UPY-GPHC_X7R_6.3V-to-50V_8.pdf?src-supplier=Avnet+Europe; ClassName: TCPP
C2 = CAP CER 4.7UF 35V X7R 0805: Manufacturer: TDK; Manufacturer Part Number: C2012X7R1V475K125AC; Dielectric Material: Ceramic; Tolerance: 10%; Supplier 1: Digi-Key; Stock 1: 109602; Pricing 1: 1=0.73, 10=0.519, 50=0.3752, 100=0.3416, 500=0.253, 1000=0.2151 (USD); Mount: Surface Mount; Case/Package: 0805; Weight: 0.000194oz; Case Code (Metric): 2012; Case Code (Imperial): 0805; Min Operating Temperature: -55°C; Max Operating Temperature: 125°C; Packaging: Tape and Reel; Package Quantity: 2000; Dielectric: X7R; Termination: SMD/SMT; Voltage Rating (DC): 35V; Length: 2mm; Height: 1.25mm; Width: 0.049inch; Thickness: 0.057inch; Depth: 1.25mm; Radiation Hardening: No; REACH SVHC: No SVHC; Lead Free: Lead Free; ComponentLink1URL: http://www.farnell.com/datasheets/2792994.pdf?src-supplier=Element14; ComponentLink1Description: http://www.farnell.com/datasheets/2792994.pdf?src-supplier=Element14; ComponentLink2URL: https://product.tdk.com/info/en/catalog/datasheets/mlcc_commercial_general_en.pdf?src-supplier=Digi-Key; ComponentLink2Description: https://product.tdk.com/info/en/catalog/datasheets/mlcc_commercial_general_en.pdf?src-supplier=Digi-Key; ComponentLink3URL: https://product.tdk.com/info/en/catalog/spec/mlccspec_commercial_general_midvoltage_en.pdf?src-supplier=Digi-Key; ComponentLink3Description: https://product.tdk.com/info/en/catalog/spec/mlccspec_commercial_general_midvoltage_en.pdf?src-supplier=Digi-Key; Supplier Part Number 1: 445-7555-1-ND
D1 = TVS DIODE ESDA25P35-1U1M 22V 41V 1610: 41V Clamp 35A (8/20µs) Ipp Tvs Diode Surface Mount 1610; Manufacturer: STMicroelectronics; Number of Unidirectional Channels: 1; Reverse Standoff Voltage: 22V; Min Breakdown Voltage: 23.3V; Peak Pulse Power: 1.4kW; Power Line Protection: No; Supplier 1: Digi-Key; Manufacturer Part Number: ESDA25P35-1U1M; Stock 1: 12413; Pricing 1: 1=0.45, 10=0.362, 25=0.3312, 100=0.2079, 250=0.2056, 500=0.1925, 1000=0.1309, 2500=0.1255 (USD); Mount: Surface Mount; Case/Package: 1610; Number of Pins: 2; Min Operating Temperature: -55°C; Max Operating Temperature: 150°C; Composition: Zener; Packaging: Tape and Reel; Clamping Voltage: 41V; Peak Pulse Current: 35A; ComponentLink1URL: http://www.st.com/content/ccc/resource/technical/document/datasheet/group3/e4/43/53/b9/4e/8a/40/bb/DM00312034/files/DM00312034.pdf/jcr:content/translations/en.DM00312034.pdf?src-supplier=Digi-Key; ComponentLink1Description: http://www.st.com/content/ccc/resource/technical/document/datasheet/group3/e4/43/53/b9/4e/8a/40/bb/DM00312034/files/DM00312034.pdf/jcr:content/translations/en.DM00312034.pdf?src-supplier=Digi-Key; ComponentLink2URL: http://www.farnell.com/datasheets/2236209.pdf?src-supplier=Farnell; ComponentLink2Description: http://www.farnell.com/datasheets/2236209.pdf?src-supplier=Farnell; ComponentLink3URL: http://www.farnell.com/datasheets/2236209.pdf?src-supplier=Element14; ComponentLink3Description: http://www.farnell.com/datasheets/2236209.pdf?src-supplier=Element14; ComponentLink4URL: http://www.farnell.com/datasheets/2236209.pdf?src-supplier=Newark; ComponentLink4Description: http://www.farnell.com/datasheets/2236209.pdf?src-supplier=Newark; Supplier Part Number 1: 497-16913-1-ND
NT1 = Net Tie Line: ClassName: Net Tie
P10 = CONN 2012670005 RCP USB3.1 TYPEC 24P SMD RA: USB-C (USB TYPE-C) USB 3.2 Gen 2 (USB 3.1 Gen 2, Superspeed + (USB 3.1)) Receptacle Connector 24 Position Surface Mount, Right Angle; Through Hole; Manufacturer: Molex; Manufacturer Part Number: 201267-0005; Number of Contacts: 24; Number of Ports: 1; Current Rating: 5A; Voltage Rating: 30V; Mating Cycles: 20000; Shielding: Shielded; Supplier 1: Digi-Key; Stock 1: 2580; Pricing 1: 1=2.34, 10=1.997, 100=1.6496 (USD); Mount: Surface Mount,Through Hole; Packaging: Tape and Reel; Connector Type: USB; Gender: Receptacle; ComponentLink1URL: https://www.molex.com/pdm_docs/sd/2012670005_sd.pdf?src-supplier=Digi-Key; ComponentLink1Description: https://www.molex.com/pdm_docs/sd/2012670005_sd.pdf?src-supplier=Digi-Key; ComponentLink2URL: http://www.farnell.com/datasheets/2722545.pdf?src-supplier=Element14; ComponentLink2Description: http://www.farnell.com/datasheets/2722545.pdf?src-supplier=Element14; Supplier Part Number 1: WM17992CT-ND; Contact Plating: Gold; Insulation Color: Black; Min Operating Temperature: -40°C; Max Operating Temperature: 105°C; Termination: Solder; Flammability Rating: UL94 V-0; ComponentLink3URL: http://www.farnell.com/datasheets/2722545.pdf?src-supplier=Newark; ComponentLink3Description: http://www.farnell.com/datasheets/2722545.pdf?src-supplier=Newark; ComponentLink4URL: https://www.molex.com/pdm_docs/pk/2012670005-PK1.pdf?src-supplier=Digi-Key; ComponentLink4Description: https://www.molex.com/pdm_docs/pk/2012670005-PK1.pdf?src-supplier=Digi-Key; ComponentLink5URL: http://www.farnell.com/datasheets/2722545.pdf?src-supplier=Farnell; ComponentLink5Description: http://www.farnell.com/datasheets/2722545.pdf?src-supplier=Farnell
Q1 = ARRAY MOSFET 2N-CH 30V 0.4A SOT-563: Mosfet Array 2 N-Channel (Dual) 30V 400mA 400mW Surface Mount SOT-563; Manufacturer: Diodes; Gate to Source Voltage (Vgs): 10V; Rds On Max: 1.2R; Input Capacitance: 39pF; Number of Channels: 2; Supplier 1: Digi-Key; Manufacturer Part Number: DMN32D2LV-7; Stock 1: 141366; Pricing 1: 1=0.39, 10=0.338, 25=0.3152, 100=0.234, 500=0.1827, 1000=0.1485 (USD); Mount: Surface Mount; Min Operating Temperature: -55°C; Max Operating Temperature: 150°C; Continuous Drain Current (ID): 400mA; Package Quantity: 3000; Packaging: Tape and Reel; Drain to Source Voltage (Vdss): 30V; Max Power Dissipation: 400mW; Drain to Source Breakdown Voltage: 30V; Drain to Source Resistance: 1.2R; Element Configuration: Dual; FET Type: 2 N-Channel; Length: 1.6mm; Height: 0.6mm; Width: 1.2mm; Radiation Hardening: No; REACH SVHC: No SVHC; ComponentLink1URL: https://www.diodes.com/assets/Datasheets/ds31121.pdf?src-supplier=Digi-Key; ComponentLink1Description: https://www.diodes.com/assets/Datasheets/ds31121.pdf?src-supplier=Digi-Key; ComponentLink2URL: http://www.mouser.com/ds/2/115/ds31121-89496.pdf?src-supplier=Mouser; ComponentLink2Description: http://www.mouser.com/ds/2/115/ds31121-89496.pdf?src-supplier=Mouser; ComponentLink3URL: http://www.diodes.com///datasheets/ds31121.pdf?src-supplier=Avnet; ComponentLink3Description: http://www.diodes.com///datasheets/ds31121.pdf?src-supplier=Avnet; Supplier Part Number 1: DMN32D2LV-7DICT-ND; Case/Package: SOT-563; Weight: 0.000106oz; Polarity: N-CHANNEL; Series: -; ClassName: TCPP
R3 R4 = RES SMD 100K OHM 1% 1/16W 0402: as R37 on sheet Analog_Signal_Conditioner_V2; Supplier 1: Digi-Key; Stock 1: 47448883; Pricing 1: 1=0.1, 10=0.016, 100=0.0064, 1000=0.0029, 2500=0.0025, 5000=0.0021 (USD); Case Code (Metric): 1005; Case Code (Imperial): 0402; Min Operating Temperature: -55°C; Max Operating Temperature: 155°C; Composition: Thick Film; Packaging: Tape and Reel; Package Quantity: 1; Number of Terminations: 2; Termination: SMD/SMT; Military Standard: Not; Max Power Dissipation: 63mW; Working Voltage: 50V; Features: Moisture Resistant; Length: 0.039inch; Height: 0.016inch; Width: 0.02inch; Depth: 0.5mm; REACH SVHC: No SVHC; Lead Free: Lead Free; ComponentLink1URL: http://www.yageo.com/documents/recent/PYu-RC_Group_51_RoHS_L_10.pdf?src-supplier=Digi-Key; ComponentLink1Description: http://www.yageo.com/documents/recent/PYu-RC_Group_51_RoHS_L_10.pdf?src-supplier=Digi-Key; ComponentLink2URL: http://www.farnell.com/datasheets/1018594.pdf?src-supplier=Element14; ComponentLink2Description: http://www.farnell.com/datasheets/1018594.pdf?src-supplier=Element14; ComponentLink3URL: http://www.yageo.com/documents/recent/PYu-RC_Group_51_RoHS_L_9.pdf?src-supplier=Verical; ComponentLink3Description: http://www.yageo.com/documents/recent/PYu-RC_Group_51_RoHS_L_9.pdf?src-supplier=Verical; ComponentLink4URL: http://www.yageo.com/documents/recent/PYu-RC_Group_51_RoHS_L_9.pdf?src-supplier=Mouser; ComponentLink4Description: http://www.yageo.com/documents/recent/PYu-RC_Group_51_RoHS_L_9.pdf?src-supplier=Mouser; ComponentLink5URL: http://documents.rs-components.com/techlib://itc_doclist_GB.htm?stockno=6185797&src-supplier=RSComponents; ComponentLink5Description: http://documents.rs-components.com/techlib://itc_doclist_GB.htm?stockno=6185797&src-supplier=RSComponents; Supplier Part Number 1: 311-100KLRDKR-ND; Case/Package: 0402; ClassName: TCPP; Mount: Surface Mount
R5 R8 = RES SMD NO BOM 0402: Placeholder for a 0402 resistor
R6 R9-R11 = RES SMD 10K OHM 1% 1/16W 0402: 10 kOhms ±1% 0.063W, 1/16W Chip Resistor 0402 (1005 Metric) Moisture Resistant Thick Film; Manufacturer: Yageo; Manufacturer Part Number: RC0402FR-0710KP; Max Power Dissipation: 63mW; Temperature Coefficient: 150ppm/°C; Supplier 1: Digi-Key; Stock 1: 839368; Pricing 1: 1=0.1, 10=0.035, 100=0.014, 1000=0.0063, 2500=0.0055, 5000=0.0045 (USD); Case/Package: 0402; Case Code (Metric): 1005; Case Code (Imperial): 0402; Min Operating Temperature: -55°C; Max Operating Temperature: 155°C; Packaging: Tape and Reel; Composition: Thick Film; Number of Terminations: 2; Features: Moisture Resistant; Length: 0.039inch; Height: 0.016inch; Width: 0.02inch; ComponentLink1URL: http://www.yageo.com/NewPortal/yageodocoutput?fileName=/pdf/R-Chip/PYu-RC_51_RoHS_P_0.pdf&src-supplier=Digi-Key; ComponentLink1Description: http://www.yageo.com/NewPortal/yageodocoutput?fileName=/pdf/R-Chip/PYu-RC_51_RoHS_P_0.pdf&src-supplier=Digi-Key; Supplier Part Number 1: YAG1249CT-ND; Mount: Surface Mount
  R10 R11: ClassName: USB_MUX
R7 = RES SMD 0 OHM JUMPER 1/16W 0402: as R1 on sheet Top_Level_Block_Diagram; Supplier 1: Digi-Key; Stock 1: 46057148; Pricing 1: 1=0.1, 10=0.013, 25=0.0092, 50=0.0072, 100=0.0053, 250=0.004, 500=0.0032, 1000=0.0024, 5000=0.0017 (USD); Contact Plating: Tin,Matte; Case Code (Metric): 1005; Case Code (Imperial): 0402; Min Operating Temperature: -55°C; Max Operating Temperature: 155°C; Packaging: Tape and Reel; Composition: Thick Film; Package Quantity: 1; Number of Terminations: 2; Termination: SMD/SMT; Military Standard: Not; Features: Moisture Resistant; Length: 1mm; Height: 0.016inch; Width: 0.02inch; Depth: 0.5mm; Radiation Hardening: No; REACH SVHC: Unknown; Lead Free: Lead Free; ComponentLink1URL: http://www.yageo.com/documents/recent/PYu-RC_Group_51_RoHS_L_10.pdf?src-supplier=Digi-Key; ComponentLink1Description: http://www.yageo.com/documents/recent/PYu-RC_Group_51_RoHS_L_10.pdf?src-supplier=Digi-Key; ComponentLink2URL: http://www.yageo.com/documents/recent/PYu-RC0402_51_RoHS_L_6.pdf?src-supplier=Avnet+Europe; ComponentLink2Description: http://www.yageo.com/documents/recent/PYu-RC0402_51_RoHS_L_6.pdf?src-supplier=Avnet+Europe; ComponentLink3URL: http://www.farnell.com/datasheets/1018594.pdf?src-supplier=Element14; ComponentLink3Description: http://www.farnell.com/datasheets/1018594.pdf?src-supplier=Element14; ComponentLink4URL: https://www.verical.com/server-webapp/html/getDatasheet?partID=326379&src-supplier=Verical; ComponentLink4Description: https://www.verical.com/server-webapp/html/getDatasheet?partID=326379&src-supplier=Verical; ComponentLink5URL: http://www.farnell.com/datasheets/2167052.pdf?src-supplier=Element14; ComponentLink5Description: http://www.farnell.com/datasheets/2167052.pdf?src-supplier=Element14; Supplier Part Number 1: 311-0.0JRCT-ND; Case/Package: 0402; Mount: Surface Mount
U1 = CMC 200MA 2LN SMD ESD: 2 Line Common Mode Choke Surface Mount  200mA DCR 2.5Ohm; Manufacturer: STMicroelectronics; Number of Lines: 2; DC Resistance (DCR): 2.5R; Supplier 1: Digi-Key; Manufacturer Part Number: ECMF02-2AMX6; Stock 1: 23653; Pricing 1: 1=0.48, 10=0.418, 25=0.3888, 50=0.3288, 100=0.2989, 250=0.281, 500=0.2511, 1000=0.2033 (USD); Mount: Surface Mount; Case/Package: QFN; Number of Pins: 6; Min Operating Temperature: -40°C; Max Operating Temperature: 85°C; Packaging: Tape and Reel; Package Quantity: 1; Current: 200mA; Termination: Flat; Max Current Rating: 200mA; Current Rating: 200mA; Length: 1.75mm; Height: 0.022inch; Width: 0.059inch; Depth: 1.55mm; Radiation Hardening: No; Lead Free: Lead Free; REACH SVHC: No SVHC; ComponentLink1URL: http://www.st.com/web/en/resource/technical/document/datasheet/CD00282307.pdf?src-supplier=Future+Electronics; ComponentLink1Description: http://www.st.com/web/en/resource/technical/document/datasheet/CD00282307.pdf?src-supplier=Future+Electronics; ComponentLink2URL: http://www.st.com/content/ccc/resource/technical/document/datasheet/3a/28/cf/d0/31/63/48/8c/CD00282307.pdf/files/CD00282307.pdf/jcr:content/translations/en.CD00282307.pdf?src-supplier=Digi-Key; ComponentLink2Description: http://www.st.com/content/ccc/resource/technical/document/datasheet/3a/28/cf/d0/31/63/48/8c/CD00282307.pdf/files/CD00282307.pdf/jcr:content/translations/en.CD00282307.pdf?src-supplier=Digi-Key; ComponentLink3URL: http://www.mouser.com/ds/2/389/ecmf02-2amx6-954491.pdf?src-supplier=Mouser; ComponentLink3Description: http://www.mouser.com/ds/2/389/ecmf02-2amx6-954491.pdf?src-supplier=Mouser; ComponentLink4URL: https://www.verical.com/server-webapp/html/getDatasheet?partID=259862&src-supplier=Verical; ComponentLink4Description: https://www.verical.com/server-webapp/html/getDatasheet?partID=259862&src-supplier=Verical; Supplier Part Number 1: 497-10773-1-ND

## Sheet Test_Points.SchDoc: Test Points
size A4; DocumentNumber: 22; SheetNumber: 22; SheetTotal: 51
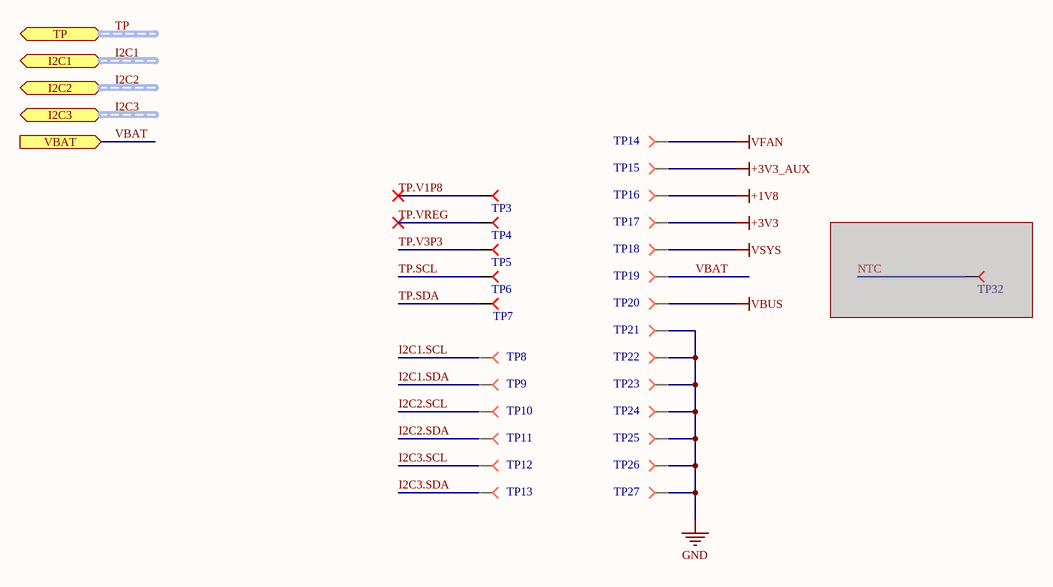
[diagram p4: Test_Points.SchDoc]

### Parts
TP3  Test Point Pad  [Testpoint]  (value not drawn)  (no BOM)
TP4  Test Point Pad  [Testpoint]  (value not drawn)  (no BOM)
TP5  Test Point Pad  [Testpoint]  (value not drawn)  (no BOM)
TP6  Test Point Pad  [Testpoint]  (value not drawn)  (no BOM)
TP7  Test Point Pad  [Testpoint]  (value not drawn)  (no BOM)
TP8  Test Point Pad  [Testpoint]  (value not drawn)  (no BOM)
TP9  Test Point Pad  [Testpoint]  (value not drawn)  (no BOM)
TP10  Test Point Pad  [Testpoint]  (value not drawn)  (no BOM)
TP11  Test Point Pad  [Testpoint]  (value not drawn)  (no BOM)
TP12  Test Point Pad  [Testpoint]  (value not drawn)  (no BOM)
TP13  Test Point Pad  [Testpoint]  (value not drawn)  (no BOM)
TP14  Test Point Pad  [Testpoint]  (value not drawn)  (no BOM)
TP15  Test Point Pad  [Testpoint]  (value not drawn)  (no BOM)
TP16  Test Point Pad  [Testpoint]  (value not drawn)  (no BOM)
TP17  Test Point Pad  [Testpoint]  (value not drawn)  (no BOM)
TP18  Test Point Pad  [Testpoint]  (value not drawn)  (no BOM)
TP19  Test Point Pad  [Testpoint]  (value not drawn)  (no BOM)
TP20  Test Point Pad  [Testpoint]  (value not drawn)  (no BOM)
TP21  Test Point Pad  [Testpoint]  (value not drawn)  (no BOM)
TP22  Test Point Pad  [Testpoint]  (value not drawn)  (no BOM)
TP23  Test Point Pad  [Testpoint]  (value not drawn)  (no BOM)
TP24  Test Point Pad  [Testpoint]  (value not drawn)  (no BOM)
TP25  Test Point Pad  [Testpoint]  (value not drawn)  (no BOM)
TP26  Test Point Pad  [Testpoint]  (value not drawn)  (no BOM)
TP27  Test Point Pad  [Testpoint]  (value not drawn)  (no BOM)
TP32  Test Point Pad  [Testpoint]  (value not drawn)  (no BOM)  (masked out: inside a compile mask, not in the netlist)

### Ports
I2C1 (harness I2C), I2C2 (harness I2C), I2C3 (harness I2C), TP (harness DRV10975_TP), VBAT (in)

### Nets
+1V8: TP16.1
+3V3: TP17.1
+3V3_AUX: TP15.1
GND: TP21.1 TP22.1 TP23.1 TP24.1 TP25.1 TP26.1 TP27.1
VBUS: TP20.1
VFAN: TP14.1
VSYS: TP18.1
I2C1.SCL: TP8.1
I2C1.SDA: TP9.1
I2C2.SCL: TP10.1
I2C2.SDA: TP11.1
I2C3.SCL: TP12.1
I2C3.SDA: TP13.1
TP.SCL: TP6.1
TP.SDA: TP7.1
TP.V1P8: TP3.1
TP.V3P3: TP5.1
TP.VREG: TP4.1
VBAT: TP19.1 ; port VBAT

### Buses and harness runs
harness I2C1 = port I2C1
harness I2C2 = port I2C2
harness I2C3 = port I2C3
harness TP = port TP

### Notes on the sheet
- Title
- Size:
- Date:
- A4
- Number:
- Time:
- Revision:
- Sheet
- of
- File:

### Library data of the parts
TP3-TP27 TP32 = Test Point Pad: Test Point. There is nothing to buy or mount.; ClassName: TestPoint; CompType: TestPoint; Manufacturer: N/A; MountType: N/A; PackageReference: TetsPoint; PartNumber: N/A